# EAGLE design slimme_meter3 (EAGLE 7.5.0)
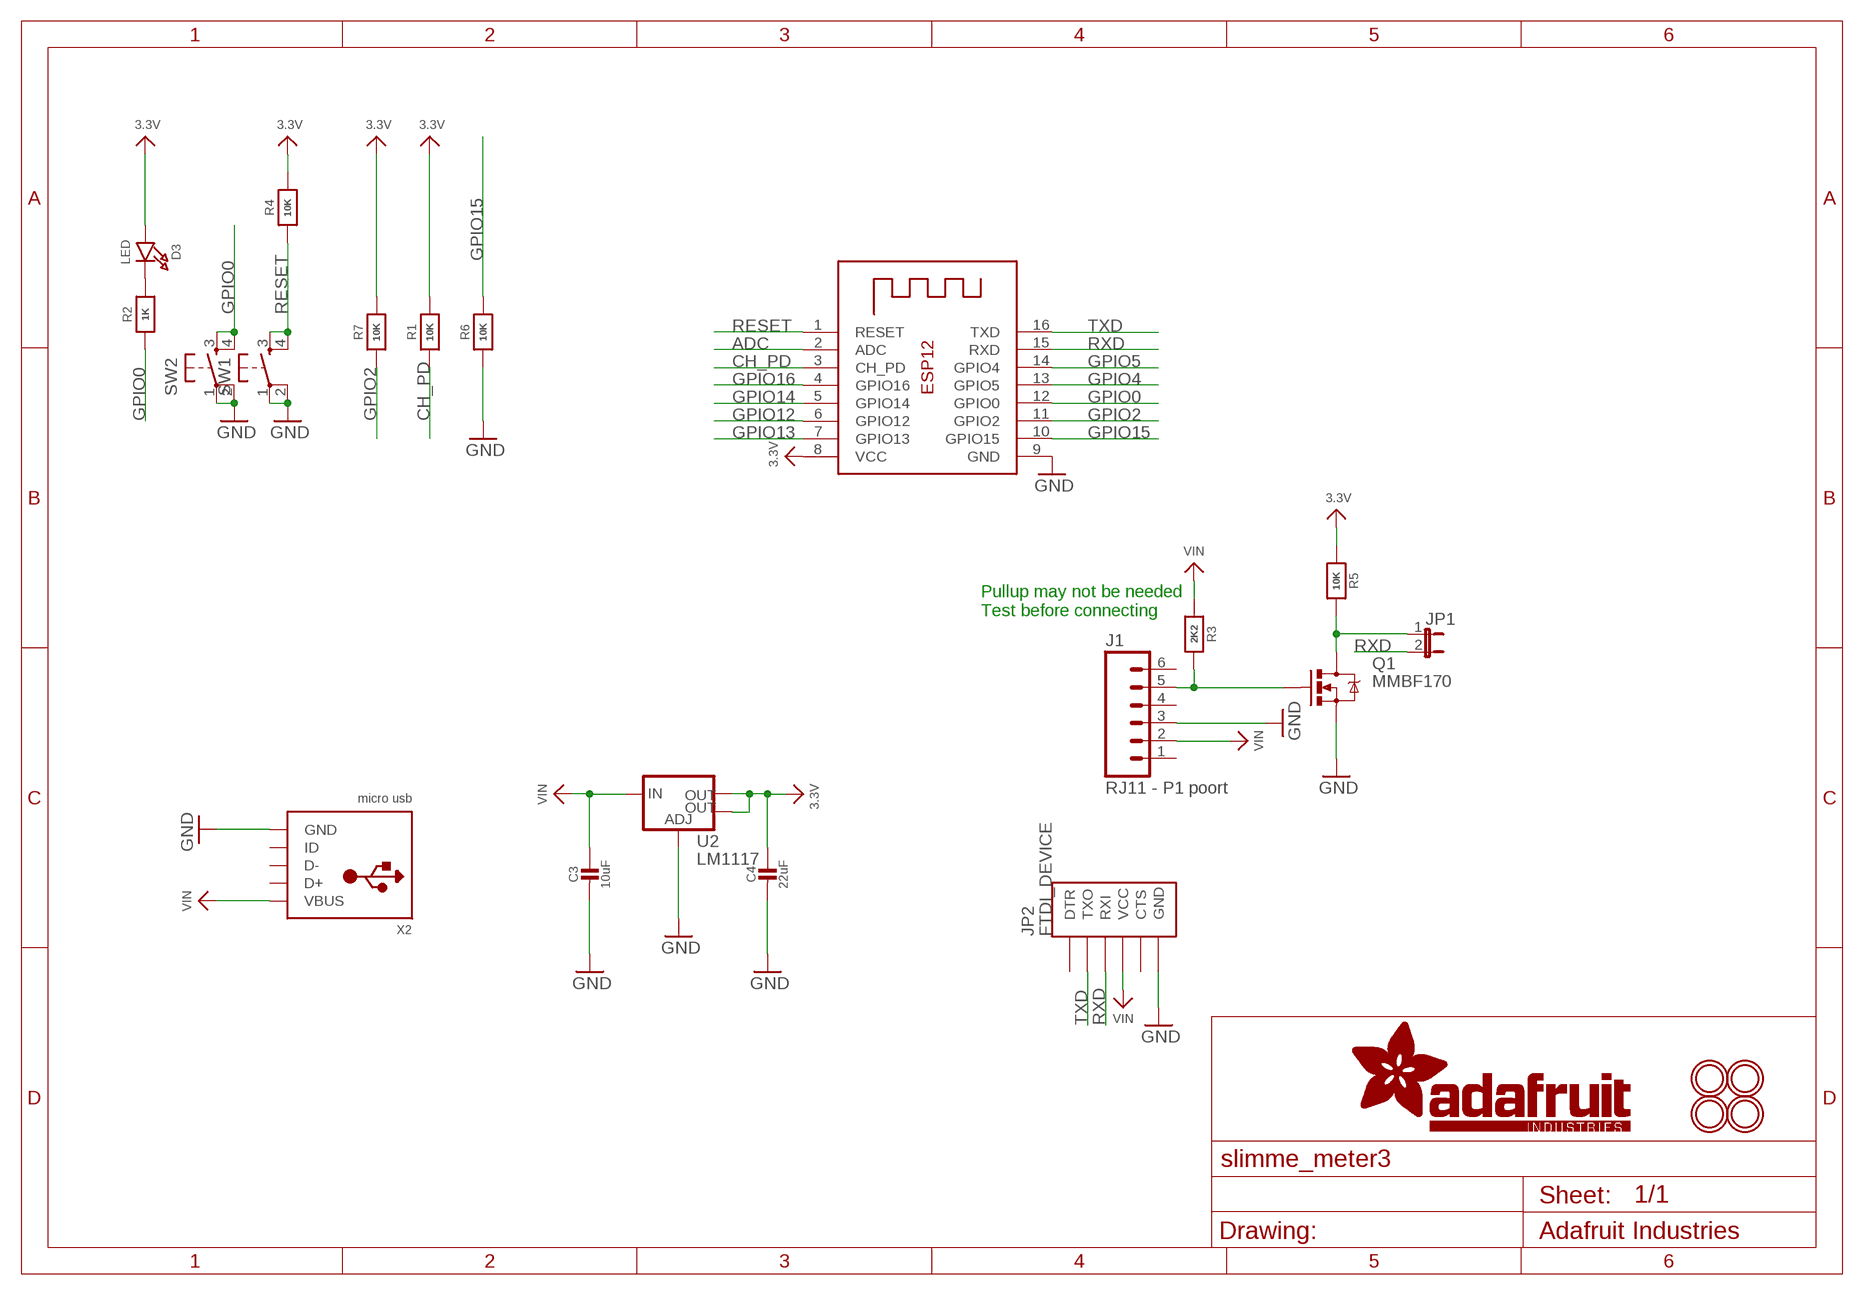
[diagram p0: schematic, sheet 1]

## Parts
C3  10uF  CAP_CERAMIC0805-NOOUTLINE  [0805-NO]
C4  22uF  CAP_CERAMIC0805-NOOUTLINE  [0805-NO]
D3  LED  LED0805_NOOUTLINE  [CHIPLED_0805_NOOUTLINE]
J1  RJ11 - P1 poort  RJ11-6PTH  [RJ11-6]
JP1  JUMPER-2PTH  [1X02]
JP2  FTDI_DEVICE  [FTDI_DEVICE_SIDE]
Q1  MMBF170  MOSFET-NCHANNEL2N7002PW  [SOT323]
R1  10K  RESISTOR0805_NOOUTLINE  [0805-NO]
R2  1K  RESISTOR0805_NOOUTLINE  [0805-NO]
R3  2K2  RESISTOR0805_NOOUTLINE  [0805-NO]
R4  10K  RESISTOR0805_NOOUTLINE  [0805-NO]
R5  10K  RESISTOR0805_NOOUTLINE  [0805-NO]
R6  10K  RESISTOR0805_NOOUTLINE  [0805-NO]
R7  10K  RESISTOR0805_NOOUTLINE  [0805-NO]
SW1  TACTILE-SWITCH-PTH  [TAC-SWITCH-PTH]
SW2  TACTILE-SWITCH-PTH  [TAC-SWITCH-PTH]
U2  LM1117  V_REG_LM1117SOT223  [SOT223]
U$15  MOUNTINGHOLE2.5  [MOUNTINGHOLE_2.5_PLATED]
U$16  MOUNTINGHOLE2.5  [MOUNTINGHOLE_2.5_PLATED]
U$17  MOUNTINGHOLE2.5  [MOUNTINGHOLE_2.5_PLATED]
U$18  MOUNTINGHOLE2.5  [MOUNTINGHOLE_2.5_PLATED]
X1  ESP-12  [ESP-12]
X2  micro usb  USBMICRO_20329  [4UCONN_20329]

## Nets
3.3V: C4.1 D3.A R1.2 R4.2 R5.1 R7.2 U2.2(OUT) U2.4(OUT) X1.8(VCC)
ADC: X1.2(ADC)
CH_PD: R1.1 X1.3(CH_PD)
GND: C3.2 C4.2 J1.3 JP2.P$6(GND) Q1.2(S) R6.1 SW1.1 SW1.2 SW2.1 SW2.2 U2.1(ADJ) X1.9(GND) X2.BASE@1(GND) X2.BASE@2(GND) X2.GND X2.SPRT@1(GND) X2.SPRT@2(GND) X2.SPRT@3(GND) X2.SPRT@4(GND)
GPIO0: R2.1 SW2.3 SW2.4 X1.12(GPIO0)
GPIO2: R7.1 X1.11(GPIO2)
GPIO4: X1.13(GPIO5)
GPIO5: X1.14(GPIO4)
GPIO12: X1.6(GPIO12)
GPIO13: X1.7(GPIO13)
GPIO14: X1.5(GPIO14)
GPIO15: R6.2 X1.10(GPIO15)
GPIO16: X1.4(GPIO16)
N$1: D3.C R2.2
N$2: JP1.1 Q1.3(D) R5.2
N$4: J1.5 Q1.1(G) R3.2
RESET: R4.1 SW1.3 SW1.4 X1.1(RESET)
RXD: JP1.2 JP2.P$3(RXI) X1.15(RXD)
TXD: JP2.P$2(TXO) X1.16(TXD)
VIN: C3.1 J1.2 JP2.P$4(VCC) R3.1 U2.3(IN) X2.VBUS
Unconnected: J1.1 J1.4 J1.6 JP2.P$1(DTR) JP2.P$5(CTS) X2.D+ X2.D- X2.ID

## Notes on the sheet
- Pullup may not be needed
  Test before connecting

## Library data of the parts
C3 C4 = microbuilder:CAP_CERAMIC: Ceramic Capacitors For new designs, use the packages preceded by an '_' character since they are more reliable: The following footprints should be used on most boards: _0402 - Standard footprint for regular board layouts _0603 - Standard footprint for regular board layouts _0805 - Standard footprint for regular board layouts _1206 - Standard footprint for regular board layouts For extremely tight-pitch boards where space is at a premium, the following 'micro-pitch' footprints can be used (smaller pads, no silkscreen outline, etc.): _0402MP - Micro-pitch footprint for very dense/compact boards _0603MP - Micro-pitch footprint for very dense/compact boards _0805MP - Micro-pitch footprint for very dense/compact boards _1206MP - Micro-pitch footprint for very dense/compact boards
D3 = microbuilder:LED: LED 0603 - 0603 Surface Mount Package 2mA: Green LED - Low Power (3.9mcd, 2ma, 1.7Vf) - Digikey: 475-2709-2-ND Orange LED - Low Power (9.8mcd, 2ma, 1.8Vf) - Digikey: 475-1194-2-ND Red LED - Low Power (5mcd, 2ma, 1.8Vf) - Digikey: 475-1195-2-ND Yellow LED - Low Power (7mcd, 2ma, 1.8Vf) - Digikey: 475-1196-2-ND 5mA: Blue LED - Low Power (17mcd, 5ma, 2.9Vf) - Digikey: LNJ937W8CRACT-ND 0805 - 0805 Surface Mount Package 2mA: Red LED (8.8mcd, 2mA, 1.8Vf, Clear) - Low Power [Digikey: 475-2510-1-ND] Green LED (5mcd, 2mA, 1.8Vf, Clear) - Low Power [Digikey: 475-2730-1-ND] Yellow LED (11.3mcd, 2mA, 1.8Vf, Clear) - Low Power [Digikey: 475-2555-1-ND] 20mA: Red LED (104mcd, 20mA, Diffused) - LS R976 [Digikey: 475-1278-6-ND] Red LED (12mcd, 20mA, 2.0Vf, Clear) - APT2012EC [Digikey: 754-1128-1-ND] Green LED (15mcd, 20mA, 2.2Vf, Clear) - APT2012GC [Digikey: 754-1131-1-ND] Orange LED (160mcd, 20mA, 2.1Vf, Clear) - APT2012SECK [Digikey: 754-1130-1-ND] 1206 - 1206 Surface Mount Package Green LED (26mcd, 20mA, Diffused) - LG N971 [Digikey: 475-1407-6-ND] Red LED (15mcd, 20mA, Diffused) - LH N974 [Digikey: 475-1416-6-ND] Cree - Cree High-Power Surface Mount LEDs XPEBWT-L1-0000-00D50 - White 111lm 350mA 2.9Vf 6200K 110° XTEAWT-00-0000-00000LEE3 - White 114lm 350mA 2.85Vf 5000K 115° Everlight - Everlight 45-21 Series Surface Mount LEDs 45-21/QK2C-B2832AC2CB2/2T - Warm White 2000mcd 20mA 3.25Vf 3050K 120° 45-21/LK2C-B38452C4CB2/2T - Nuetral White 2000mcd 20mA 3.25Vf 4150K 120° 45-21/LK2C-B50634C6CB2/2T - Cold White 2200mcd 20mA 3.25Vf 5650K 120° PLCC2 Reverse Mount LS T77K-J1L2-1-0-2-R18-Z - Red 11.25mcd 2mA 1.8Vf 630nm 120° LO T77K-L1M2-24-Z - Orange 19.6mcd 2mA 1.8Vf 606nm 120° LY T77K-K2M1-26-Z - Yellow 15.7mcd 2mA 1.8Vf 587nm 120°
J1 = SparkFun-Connectors:RJ11-6: RJ11 Jack Simple 6 pin RJ11 jack. Commonly found on CAT3 devices and Microchip programmers. SKU: PRT-00132; PROD_ID: CONN-08590; VALUE: RJ11
JP1 = SparkFun-Retired:JUMPER-2: Jumper Basic 0.1" spaced jumper. Use with breakaway headers.
JP2 = SparkFun-Connectors:FTDI_DEVICE: Connector which mates to FTDI basic or FTDI cable.
Q1 = SparkFun-DiscreteSemi:MOSFET-NCHANNEL: Common NMOSFET Parts MFG P/N Store ID Prod ID FDD8780 TRANS-09984 SI7820DN TRANS-11055 FDS6630A IC-08089 2N7002PW TRANS-11151 FQP30N06L COM-10213 TRANS-10060 BSS123LT1G TRANS-08345 BSS138 TRANS-00830 BS170 2N7000; PROD_ID: TRANS-11151
R1-R7 = microbuilder:RESISTOR: Resistors For new designs, use the packages preceded by an '_' character since they are more reliable: The following footprints should be used on most boards: _0402 - Standard footprint for regular board layouts _0603 - Standard footprint for regular board layouts _0805 - Standard footprint for regular board layouts _1206 - Standard footprint for regular board layouts For extremely tight-pitch boards where space is at a premium, the following 'micro-pitch' footprints can be used (smaller pads, no silkscreen outline, etc.): _0402MP - Micro-pitch footprint for very dense/compact boards _0603MP - Micro-pitch footprint for very dense/compact boards _0805MP - Micro-pitch footprint for very dense/compact boards _1206MP - Micro-pitch footprint for very dense/compact boards
SW1 SW2 = GeekAmmo:TACTILE-SWITCH: Tactile Switch 4 Pins, SPST NO
U2 = SparkFun-PowerIC:V_REG_LM1117: Voltage Regulator LM1117 Standard adjustable voltage regulator but in SMD form. Spark Fun Electronics SKU : COM-00595; PROD_ID: VREG-08170
U$15-U$18 = microbuilder:MOUNTINGHOLE: Mounting Hole For #2 screws (0.086"/2.18mm width, 0.094"/2.4mm hole) use 2.5mm; BOM: EXCLUDE
X1 = microbuilder:ESP-12
X2 = microbuilder:USB: USB Connectors USBMINIB - Surface Mount Female Mini-B USB Connector 4UConnector: 06564

## Board
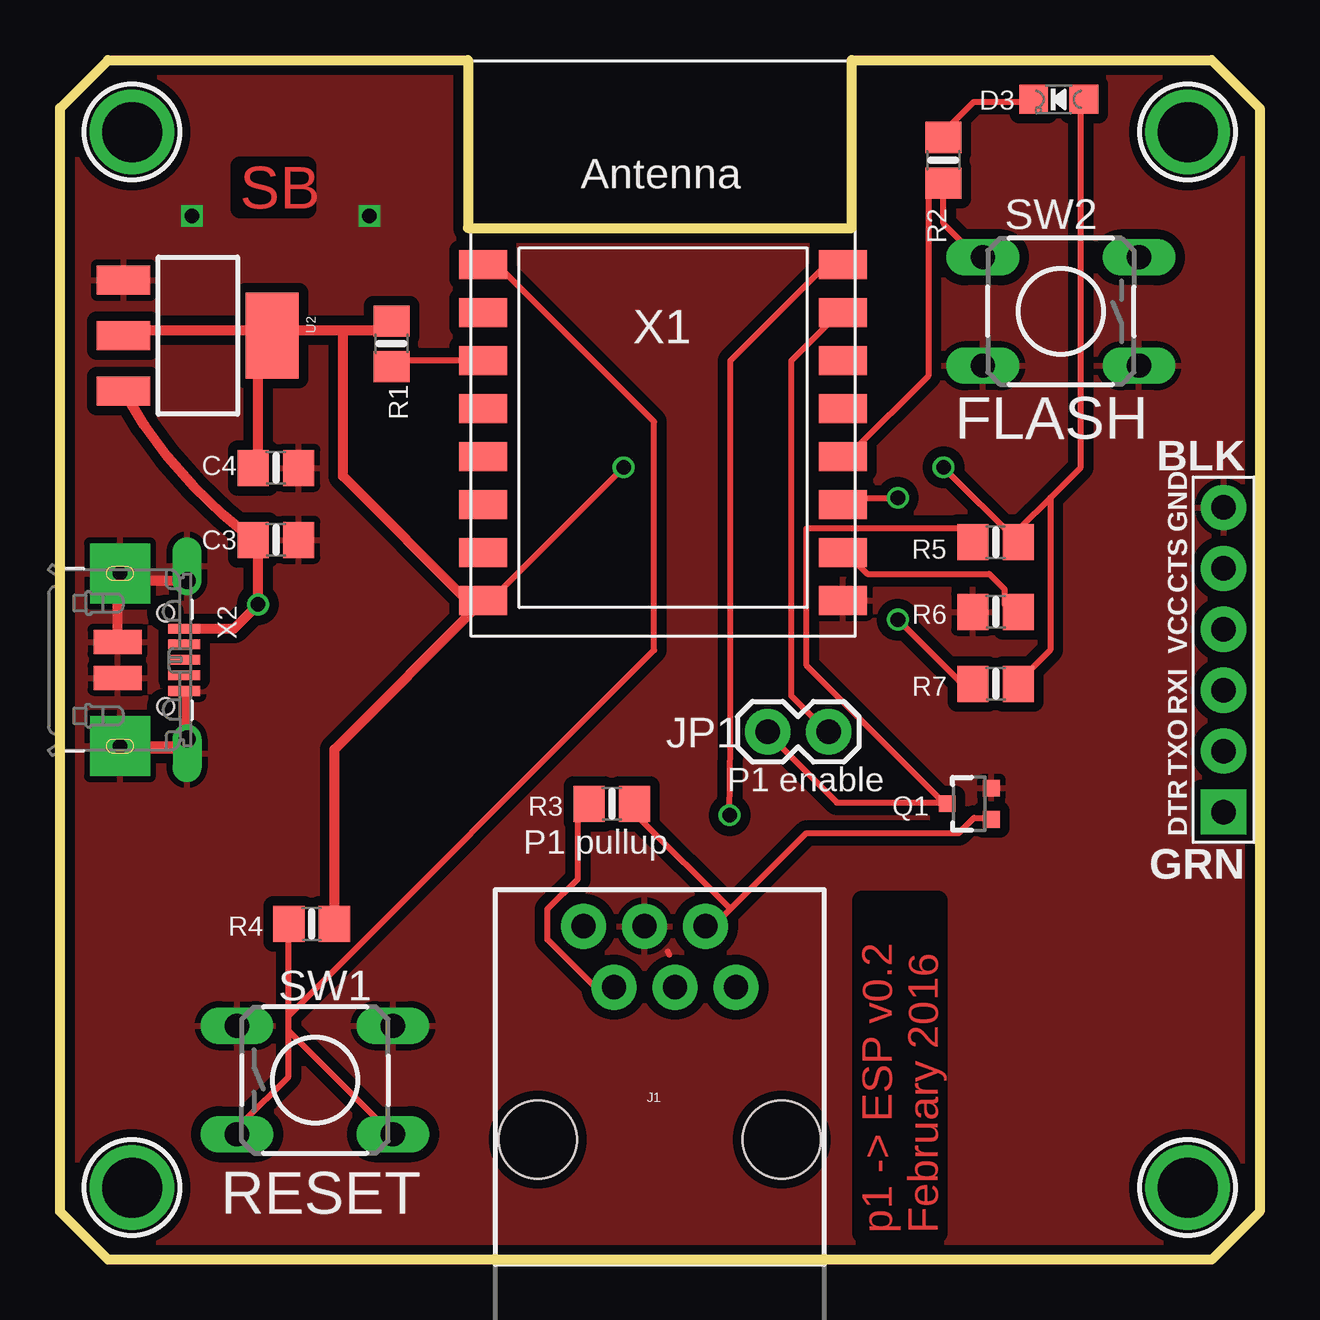
[diagram p1: board, top side]
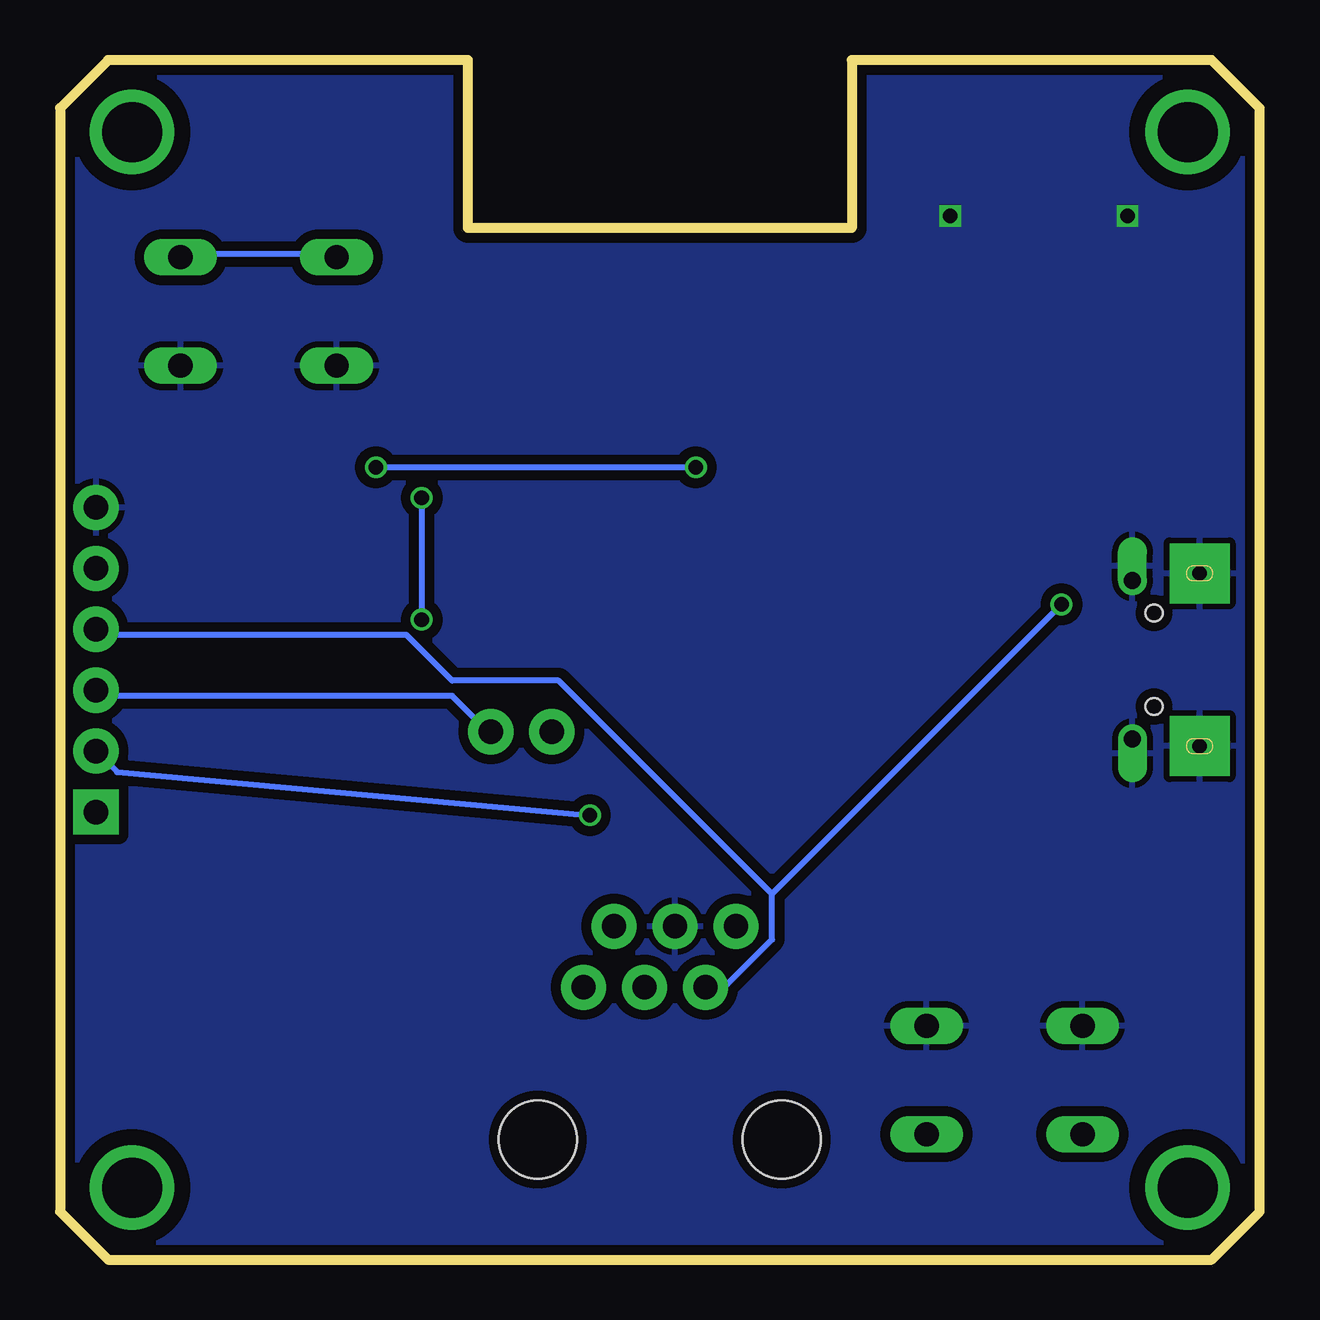
[diagram p2: board, bottom side, seen from below]

Size 50 x 50 mm. Coordinates in mm from the lower left corner, seen from the top.
Outline: 2,0 0,2 0,48 2,50 17,50 17,43 33,43 33,50 48,50 50,48 50,2 48,0 2,0
Copper layers (1*16): Top 0.035mm / dielectric 1.5mm / Bottom 0.035mm
Design rules "SeeedStudio_2layer_DRU_no_angle_20140221": minimum track width 6mil, minimum drill 12mil, track to track 6mil, track to pad 6mil, pad to pad 6mil, via to via 6mil, smd to smd 0mil, copper to edge 10mil, drill to drill 10mil, minimum pad ring 10mil, minimum via ring 6mil, stop-mask expansion 2mil, vias tented up to drill 100mil, thermal gap 10mil

### Footprints (pad centres in the part's own frame; a part is rotated, then mirrored left to right if it is on the bottom)
0805-NO = smd 1.3 x 1.5: 1 -0.95,0; 2 0.95,0
CHIPLED_0805_NOOUTLINE = smd 1.2 x 1.2: A 0,-1.05; C 0,1.05
RJ11-6 = drill 1.016 pad 1.88: 1 -3.175,8.89; 2 -1.905,6.35; 3 -0.635,8.89; 4 0.635,6.35; 5 1.905,8.89; 6 3.175,6.35 | hole 3.251: -5.08,0; 5.08,0
1X02 = drill 1.016 pad 1.88: 1 0,0; 2 2.54,0
FTDI_DEVICE_SIDE = drill 1.016 pad 1.88 square: P$1 -6.35,0 | drill 1.016 pad 1.88: P$2 -3.81,0; P$3 -1.27,0; P$4 1.27,0; P$5 3.81,0; P$6 6.35,0
SOT323 = smd 0.7 x 0.7: 1 -0.65,-0.925; 2 0.65,-0.925; 3 0,0.925
TAC-SWITCH-PTH = drill 1.016 pad 1.524 long: 1 -3.251,2.261; 2 3.251,2.261; 3 -3.251,-2.261; 4 3.251,-2.261
SOT223 = smd 1.219 x 2.235: 1 -2.311,-3.099; 2 0,-3.099; 3 2.311,-3.099 | smd 3.6 x 2.2: 4 0,3.099
MOUNTINGHOLE_2.5_PLATED = drill 2.5 pad 3.2: P$1 0,0
ESP-12 = smd 2 x 1.2: 1 -7.5,4.5; 2 -7.5,2.5; 3 -7.5,0.5; 4 -7.5,-1.5; 5 -7.5,-3.5; 6 -7.5,-5.5; 7 -7.5,-7.5; 8 -7.5,-9.5; 9 7.5,-9.5; 10 7.5,-7.5; 11 7.5,-5.5; 12 7.5,-3.5; 13 7.5,-1.5; 14 7.5,0.5; 15 7.5,2.5; 16 7.5,4.5
4UCONN_20329 = smd 1 x 2: BASE@1 -0.75,-2; BASE@2 0.75,-2 | smd 0.4 x 1.35: D+ 0,0.775; D- -0.65,0.775; GND 1.3,0.775; ID 0.65,0.775; VBUS -1.3,0.775 | drill 0.7 offset: SPRT@1 -3.3,0.9; SPRT@2 3.3,0.9 | drill 0.6 pad 2.5 square: SPRT@3 -3.6,-1.9; SPRT@4 3.6,-1.9 | hole 0.7: -1.95,0; 1.95,0

### Placement (x,y rotation side)
C3  9,30 0 top
C4  9,33 0 top
D3  41.63,48.36 90 top
J1  25,5 0 top
JP1  29.5,22 0 top
JP2  48.5,25 90 top
Q1  37.9,19 90 top
R1  13.82,38.17 90 top
R2  36.82,45.82 90 top
R3  23,19 0 top
R4  10.49,13.99 0 top
R5  39,29.9 180 top
R6  39,27 0 top
R7  39,24 0 top
SW1  10.63,7.48 0 top
SW2  41.72,39.52 180 top
U2  5.75,38.51 270 top
U$15  47,47 0 top
U$16  47,3 0 top
U$17  3,47 0 top
U$18  3,3 0 top
X1  25.14,36.97 0 top
X2  4.4,25 270 top

### Tracks (layer width: path | path; a pad name or v marks a point on that pad's centre or on a via)
3.3V  (via drill 0.61)
  Top 0.254: 41.27,31.75 40.01,30.48 R5.1 v36.83,33.02 | 41.27,31.75 42.55,33.02 42.55,48.26 D3.A | 41.27,31.75 41.27,25.4 40.01,24.13 R7.2 | 8.26,33.02 C4.1 | 8.26,38.1 U2.4 | 13.34,38.73 R1.2 | 8.89,38.73 U2.4 | 3.17,38.73 U2.2 | 8.26,38.73 U2.4 | 17.14,27.3 X1.8 17.78,27.3 v23.5,33.02
  Top 0.406: 3.17,38.73 8.26,38.73 8.26,38.1 | 8.89,38.73 11.8,38.73 | 11.8,38.73 13.82,38.73 R1.2 | 17.14,27.3 11.8,32.65 11.8,38.73 | R4.2 11.44,21.27 X1.8 | 8.26,33.02 8.26,37.26 8.4,37.4 8.4,38.06 U2.4
  Bottom 0.254: v23.5,33.02 v36.83,33.02
CH_PD
  Top 0.254: R1.1 13.97,37.47 17.14,37.47 X1.3
GND  (via drill 0.6)
  Top 0.254: 25.4,12.7 25.34,12.82
  Top 0.406: X2.SPRT@1 2.8,28.3 X2.SPRT@3 2.4,28.5 X2.BASE@1 | X2.SPRT@4 5,21.4 X2.SPRT@2 5.3,23.57 X2.GND
  other vias: 5.5,43.5 12.9,43.5
  pour Bottom (isolate 0.406): 0.4,47.9 2.1,49.6 2.1,49.7 16.8,49.7 16.6,49.5 16.6,42.7 16.7,42.8 33.1,42.8 33.3,43 33.3,49.7 33.4,49.6 47.9,49.6 49.6,47.9 49.8,47.9 49.6,47.7 49.6,2.2 47.8,0.4 47.5,0.4 47.4,0.3 2.1,0.3 0.4,2 0.4,2.3 0.3,2.4 0.3,47.9
  pour Top (isolate 0.406): 0.4,47.8 0.4,2.2 2.2,0.4 47.8,0.4 49.6,2.1 49.6,47.8 47.8,49.6 33.4,49.6 33.4,42.7 16.7,42.7 16.7,49.7 2.2,49.7
GPIO0
  Top 0.254: SW2.4 38.1,41.91 36.83,43.18 36.83,44.45 R2.1 36.2,44.45 36.2,36.83 33.02,33.66 X1.12
  Bottom 0.254: SW2.3 44.45,41.91 38.73,41.91 SW2.4
GPIO2  (via drill 0.61)
  Top 0.254: v34.92,26.67 37.47,24.13 R7.1 | v34.92,31.75 33.02,31.75 X1.11
  Bottom 0.254: v34.92,31.75 v34.92,26.67
GPIO15
  Top 0.254: R6.2 39.37,27.3 39.37,27.94 38.73,28.57 33.66,28.57 33.02,29.21 X1.10
N$1
  Top 0.254: D3.C 40.01,48.26 38.1,48.26 36.83,46.99 R2.2
N$2
  Top 0.254: 36.83,19.05 32.38,19.05 29.84,21.59 JP1.1 | 36.83,19.05 31.11,24.77 31.11,30.48 37.47,30.48 R5.2 | 36.83,19.05 Q1.3
N$4
  Top 0.254: 27.94,14.61 27.3,13.97 J1.5 | 27.94,14.61 31.11,17.78 37.47,17.78 38.1,18.41 38.73,18.41 Q1.1 | 27.94,14.61 24.13,18.41 R3.2
N$5
  Top 0.406: 2.5,21.3 5,21.3 5.4,21.7
RESET
  Top 0.254: 9.53,9.53 9.53,7.62 7.62,5.71 SW1.3 | 9.53,9.53 9.53,10.16 | 9.53,10.16 9.53,13.97 R4.1 | 9.53,10.16 24.77,25.4 24.77,34.92 18.41,41.27 17.78,41.27 X1.1 | 9.53,9.53 13.34,5.71 SW1.4
RXD
  Top 0.254: X1.15 32.38,39.37 30.48,37.47 30.48,23.5 31.75,22.23 JP1.2
  Bottom 0.254: JP2.P$3 48.26,23.5 33.66,23.5 32.38,22.23 JP1.2
TXD  (via drill 0.61)
  Top 0.254: v27.91,18.52 27.94,21.59 27.94,37.47 31.75,41.27 32.38,41.27 X1.16
  Bottom 0.254: v27.91,18.52 47.62,20.32 48.26,20.95 JP2.P$2
VIN  (via drill 0.61)
  Top 0.254: R3.1 21.59,18.41 21.59,15.88 20.32,14.61 20.32,13.34 22.86,10.79 J1.2 | 8.26,29.84 C3.1
  Top 0.406: X2.VBUS 7.25,26.3 v8.26,27.3 8.26,29.8 C3.1 arc-24 U2.3
  Bottom 0.254: 20.32,15.24 29.21,24.13 33.66,24.13 35.56,26.04 48.26,26.04 JP2.P$4 | 20.32,15.24 20.32,13.34 22.86,10.79 J1.2 | 20.32,15.24 v8.26,27.3

### Text on the board
Top: SB | p1 -> ESP v0.2 / February 2016
tNames: FLASH | P1 enable | P1 pullup | RESET
tStop: SB | p1 -> ESP v0.2 / February 2016
tSilk: Flash | P1 Pullup | FTDI | Reset